# EAGLE design mini_metrix_clock (EAGLE 8.6.3)
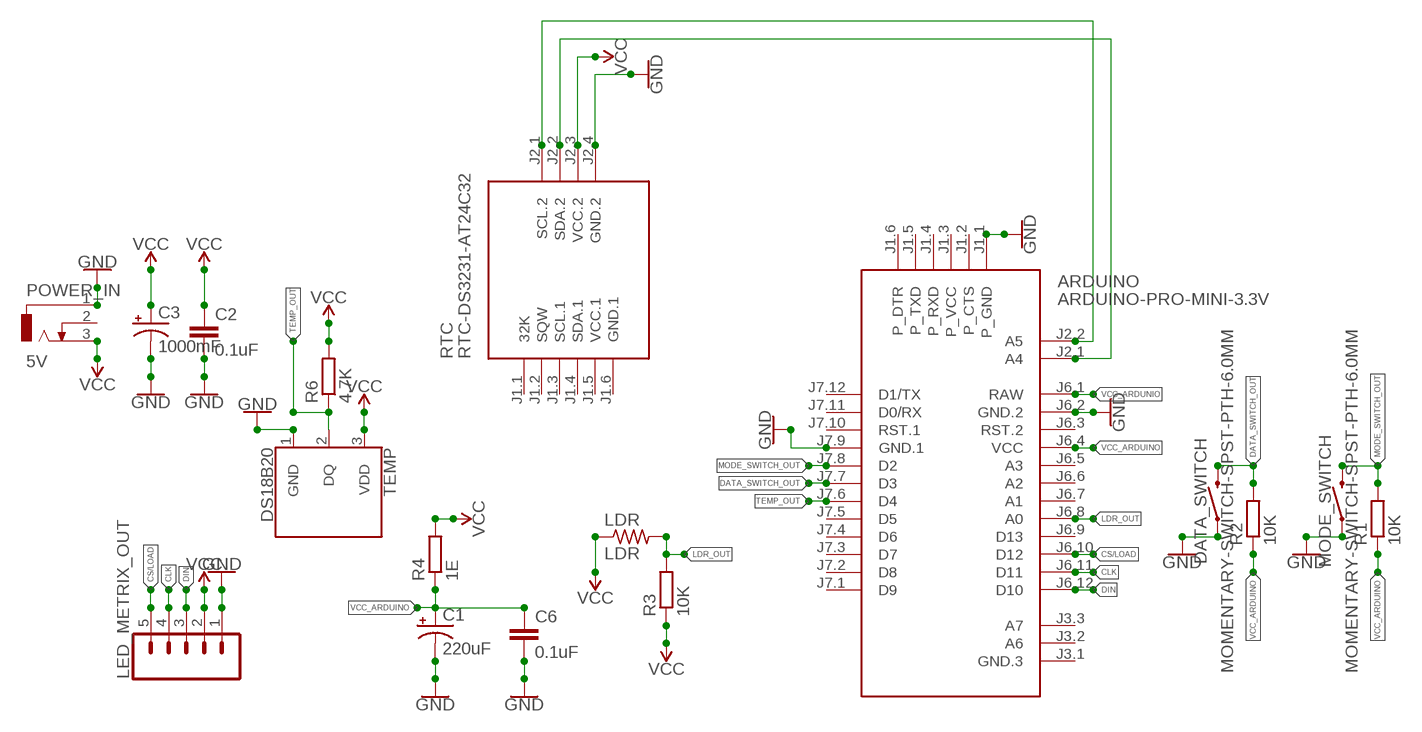
[diagram p0: schematic, sheet 1]

## Parts
ARDUINO  ARDUINO-PRO-MINI-3.3V  [ARDUINO-PRO-MINI]
C1  220uF  100UF-POLAR-RADIAL-2.5MM-25V-20%  [CPOL-RADIAL-2.5MM-6.5MM]
C2  0.1uF  0.1UF-KIT-EZ-50V-20%  [CAP-PTH-SMALL-KIT]
C3  1000mF  1000UF-RADIAL-5MM-25V-20%  [CPOL-RADIAL-5MM-10MM]
C6  0.1uF  0.1UF-KIT-EZ-50V-20%  [CAP-PTH-SMALL-KIT]
DATA_SWITCH  MOMENTARY-SWITCH-SPST-PTH-6.0MM  [TACTILE_SWITCH_PTH_6.0MM]
LDR  LDR  R-US_0204/2V  [0204V]
LED_METRIX_OUT  CONN_05PTH_LONGPADS  [1X05_LONGPADS]
MODE_SWITCH  MOMENTARY-SWITCH-SPST-PTH-6.0MM  [TACTILE_SWITCH_PTH_6.0MM]
POWER_IN  5V  DCJ0303  [DCJ0303]
R1  10K  R-EU_0207/7  [0207/7]
R2  10K  R-EU_0207/7  [0207/7]
R3  10K  R-EU_0207/7  [0207/7]
R4  1E  R-EU_0207/7  [0207/7]
R6  4.7K  R-EU_0207/7  [0207/7]
RTC  RTC-DS3231-AT24C32  [RTC-DS3231-AT24C32]
TEMP  DS18B20  [TO-92-AMMO]

## Nets
CLK: ARDUINO.J6.11(D11) LED_METRIX_OUT.4
CS/LOAD: ARDUINO.J6.10(D12) LED_METRIX_OUT.5
DATA_SWITCH_OUT: ARDUINO.J7.7(D3) DATA_SWITCH.3 R2.2
DIN: ARDUINO.J6.12(D10) LED_METRIX_OUT.3
GND: ARDUINO.J1.1(P_GND) ARDUINO.J6.2(GND.2) ARDUINO.J7.9(GND.1) C1.2(-) C2.2 C3.- C6.2 DATA_SWITCH.1 LED_METRIX_OUT.1 MODE_SWITCH.1 POWER_IN.1 RTC.J2.4(GND.2) TEMP.1(GND)
LDR_OUT: ARDUINO.J6.8(A0) LDR.2 R3.2
MODE_SWITCH_OUT: ARDUINO.J7.8(D2) MODE_SWITCH.3 R1.2
N$1: ARDUINO.J2.1(A4) RTC.J2.2(SDA.2)
N$2: ARDUINO.J2.2(A5) RTC.J2.1(SCL.2)
TEMP_OUT: ARDUINO.J7.6(D4) R6.1 TEMP.2(DQ)
VCC: C2.1 C3.+ LDR.1 LED_METRIX_OUT.2 POWER_IN.3 R3.1 R4.2 R6.2 RTC.J2.3(VCC.2) TEMP.3(VDD)
VCC_ARDUINO: ARDUINO.J6.4(VCC) C1.1(+) C6.1 R1.1 R2.1 R4.1
VCC_ARDUNIO: ARDUINO.J6.1(RAW)
Unconnected: ARDUINO.J1.2(P_CTS) ARDUINO.J1.3(P_VCC) ARDUINO.J1.4(P_RXD) ARDUINO.J1.5(P_TXD) ARDUINO.J1.6(P_DTR) ARDUINO.J3.1(GND.3) ARDUINO.J3.2(A6) ARDUINO.J3.3(A7) ARDUINO.J6.3(RST.2) ARDUINO.J6.5(A3) ARDUINO.J6.6(A2) ARDUINO.J6.7(A1) ARDUINO.J6.9(D13) ARDUINO.J7.1(D9) ARDUINO.J7.2(D8) ARDUINO.J7.3(D7) ARDUINO.J7.4(D6) ARDUINO.J7.5(D5) ARDUINO.J7.10(RST.1) ARDUINO.J7.11(D0/RX) ARDUINO.J7.12(D1/TX) POWER_IN.2 RTC.J1.1(32K) RTC.J1.2(SQW) RTC.J1.3(SCL.1) RTC.J1.4(SDA.1)

## Power pins joined to a net without a drawn wire
GND.1: RTC.J1.6(GND.1)
VCC.1: RTC.J1.5(VCC.1)

## Library data of the parts
ARDUINO = diy-modules:ARDUINO-PRO-MINI-*: Arduino Pro Mini and compatible devices More details available here: https://www.arduino.cc/en/Main/ArduinoBoardProMini Click here to find device on ebay.com <http://www.ebay.com/sch/arduino+pro+mini>
C1 = SparkFun-Capacitors:100UF-POLAR: 100µF polarized capacitors A capacitor is a passive two-terminal electrical component used to store electrical energy temporarily in an electric field.; PROD_ID: CAP-08439; VALUE: 100uF
C2 C6 = SparkFun-Capacitors:0.1UF: 0.1µF ceramic capacitors A capacitor is a passive two-terminal electrical component used to store electrical energy temporarily in an electric field.; PROD_ID: CAP-08370
C3 = SparkFun-Capacitors:1000UF: 1,000µF/1mF ceramic capacitors A capacitor is a passive two-terminal electrical component used to store electrical energy temporarily in an electric field. CAP-08070; PROD_ID: CAP-09538; VALUE: 1mF
DATA_SWITCH MODE_SWITCH = SparkFun-Switches:MOMENTARY-SWITCH-SPST: Momentary Switch (Pushbutton) - SPST Normally-open (NO) SPST momentary switches (buttons, pushbuttons). Variants PTH-12MM - 12mm square, through-hole Momentary Pushbutton Switch - 12mm Square <https://www.sparkfun.com/products/9190> (COM-09190) PTH-6.0MM, PTH-6.0MM-KIT - 6.0mm square, through-hole Mini Pushbutton Switch <https://www.sparkfun.com/products/97> (COM-00097) KIT package intended for soldering kit's - only one side of pads' copper is exposed. PTH-RIGHT-ANGLE-KIT - Right-angle, through-hole Right Angle Tactile Button <https://www.sparkfun.com/products/10791> - Used on SparkFun BigTime Watch Kit <https://www.sparkfun.com/products/11734> SMD-12MM - 12mm square, surface-mount Tactile Button - SMD (12mm) <https://www.sparkfun.com/products/12993> (COM-12993) Used on SparkFun PicoBoard <https://www.sparkfun.com/products/11888> SMD-4.5MM - 4.5mm Square Trackball Switch Used on SparkFun Blackberry Trackballer Breakout <https://www.sparkfun.com/products/13169> SMD-4.6MMX2.8MM - 4.60mm x 2.80mm, surface mount Used on SparkFun SAMD21 Mini Breakout <https://www.sparkfun.com/products/13664> SMD-5.2MM, SMD-5.2-REDUNDANT - 5.2mm square, surface-mount Mini Pushbutton Switch - SMD <https://www.sparkfun.com/products/8720> (COM-08720) Used on Arduino Pro Mini <https://www.sparkfun.com/products/11114> REDUNDANT package connects both switch circuits together SMD-6.0X3.5MM - 6.0 x 3.5mm, surface mount Momentary Reset Switch SMD <https://www.sparkfun.com/products/8229> (COM-08229) SMD-6.2MM-TALL - 6.2mm square, surface mount Tactile Button - SMD (6mm) <https://www.sparkfun.com/products/12992> Used on SparkFun Digital Sandbox <https://www.sparkfun.com/products/12651> SMD-RIGHT-ANGLE - Right-angle, surface mount Used on SparkFun Block for Intel® Edison - Arduino <https://www.sparkfun.com/products/13036>; PROD_ID: SWCH-08441; SF_SKU: COM-00097
LDR = rcl:R-US_: RESISTOR, American symbol
LED_METRIX_OUT = SparkFun-Connectors:CONN_05: Multi connection point. Often used as Generic Header-pin footprint for 0.1 inch spaced/style header connections On any of the 0.1 inch spaced packages, you can populate with these: Break Away Headers - Straight <https://www.sparkfun.com/products/116> (PRT-00116) Break Away Male Headers - Right Angle <https://www.sparkfun.com/products/553> (PRT-00553) Female Headers <https://www.sparkfun.com/products/115> (PRT-00115) Break Away Headers - Machine Pin <https://www.sparkfun.com/products/117> (PRT-00117) Break Away Female Headers - Swiss Machine Pin <https://www.sparkfun.com/products/743> (PRT-00743) For SCREWTERMINALS and SPRING TERMINALS visit here: Screw Terimnals on SparkFun.com <https://www.sparkfun.com/search/results?term=Screw+Terminals> (5mm/3.5mm/2.54mm spacing) This device is also useful as a general connection point to wire up your design to another part of your project. Our various solder wires solder well into these plated through hole pads. Hook-Up Wire - Assortment (Stranded, 22 AWG) <https://www.sparkfun.com/products/11375> (PRT-11375) Hook-Up Wire - Assortment (Solid Core, 22 AWG) <https://www.sparkfun.com/products/11367> (PRT-11367) View the entire wire category on our website here <https://www.sparkfun.com/categories/141> Special notes: Molex polarized connector foot print use with SKU : PRT-08231 with associated crimp pins and housings. 1MM SMD Version SKU: PRT-10208
POWER_IN = con-jack:DCJ0303: DC POWER JACK Source: DCJ0303.pdf; OC_FARNELL: unknown; OC_NEWARK: unknown
R1-R4 R6 = rcl:R-EU_: RESISTOR, European symbol; SPICEPREFIX: R
RTC = diy-modules:RTC-DS3231-AT24C32: RTC Module with Battery and EEPROM based on DS3231 and AT24C32 chips Tutorial can be found here: https://edwardmallon.wordpress.com/2014/05/21/using-a-cheap-3-ds3231-rtc-at24c32-eeprom-from-ebay/ Click here to find device on ebay.com <http://www.ebay.com/sch/DS3231+AT24C32+module>
TEMP = SparkFun-Sensors:DS18B20: Dallas/Maxim DS18B20 1-Wire Temperature Sensor The DS18B20 reports degrees C with 9 to 12-bit precision, -55C to 125C (+/-0.5C). Each sensor has a unique 64-Bit Serial number etched into it - allows for a huge number of sensors to be used on one data bus. Datasheet <http://datasheets.maximintegrated.com/en/ds/DS18B20.pdf> SparkFun Products One Wire Digital Temperature Sensor - DS18B20 <https://www.sparkfun.com/products/245> (SEN-00245); STORE_ID: SEN-00245

## Board
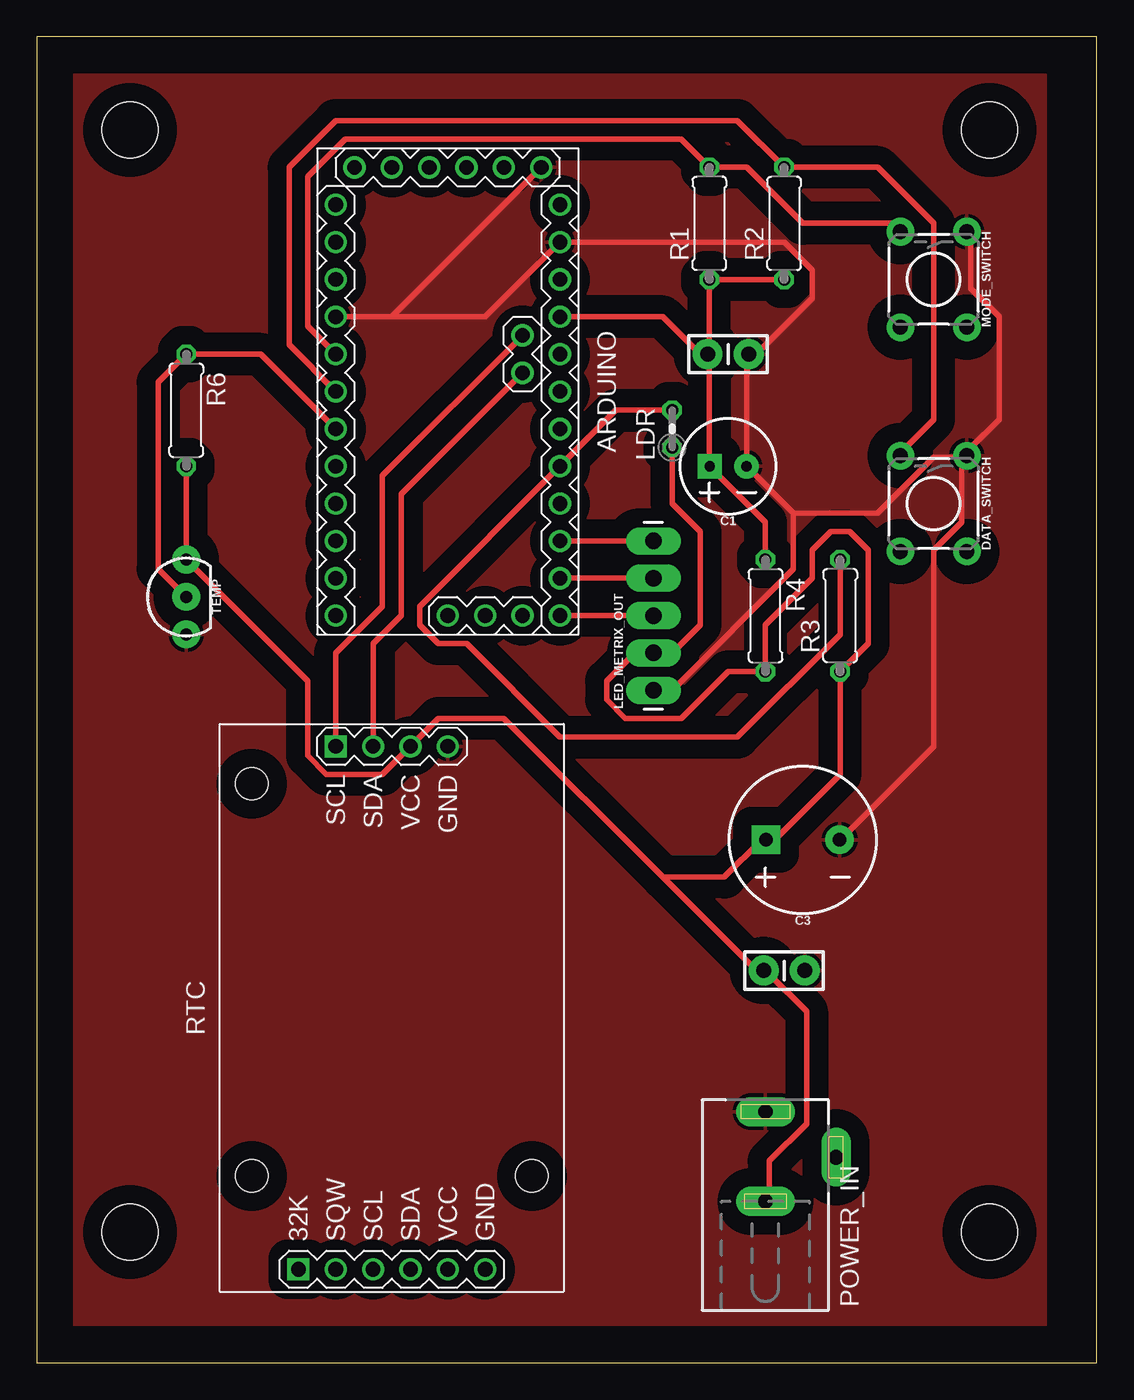
[diagram p1: board, top side]

Size 72.06 x 90.16 mm. Coordinates in mm from the lower left corner, seen from the top.
Outline: 0,0 72.06,0 72.06,90.16 0,90.16 0,0
Copper layers (1*16): Top 0.035mm / dielectric 1.5mm / Bottom 0.035mm
Design rules "default *": minimum track width 15mil, minimum drill 1mm, track to track 25mil, track to pad 20mil, pad to pad 6mil, via to via 6mil, smd to smd 6mil, copper to edge 40mil, drill to drill 6mil, minimum pad ring 10mil, minimum via ring 8mil, stop-mask expansion 4mil, vias tented up to drill 0mil, thermal gap 10mil
Holes 3.81 mm at 6.35,83.82 64.77,83.82 64.77,8.89 6.35,8.89

### Footprints (pad centres in the part's own frame; a part is rotated, then mirrored left to right if it is on the bottom)
ARDUINO-PRO-MINI = drill 1: J1.1 -15.24,6.35; J1.2 -15.24,3.81; J1.3 -15.24,1.27; J1.4 -15.24,-1.27; J1.5 -15.24,-3.81; J1.6 -15.24,-6.35; J2.1 -1.27,5.08; J2.2 -3.81,5.08; J3.1 15.24,0; J3.2 15.24,2.54; J3.3 15.24,5.08; J6.1 -12.7,7.62; J6.2 -10.16,7.62; J6.3 -7.62,7.62; J6.4 -5.08,7.62; J6.5 -2.54,7.62; J6.6 0,7.62; J6.7 2.54,7.62; J6.8 5.08,7.62; J6.9 7.62,7.62; J6.10 10.16,7.62; J6.11 12.7,7.62; J6.12 15.24,7.62; J7.1 15.24,-7.62; J7.2 12.7,-7.62; J7.3 10.16,-7.62; J7.4 7.62,-7.62; J7.5 5.08,-7.62; J7.6 2.54,-7.62; J7.7 0,-7.62; J7.8 -2.54,-7.62; J7.9 -5.08,-7.62; J7.10 -7.62,-7.62; J7.11 -10.16,-7.62; J7.12 -12.7,-7.62
CPOL-RADIAL-2.5MM-6.5MM = drill 0.7 pad 1.651 square: 1 1.25,0 | drill 0.7 pad 1.651: 2 -1.25,0
CAP-PTH-SMALL-KIT = drill 1.016 pad 2.032: 1 -1.397,0; 2 1.397,0
CPOL-RADIAL-5MM-10MM = drill 0.9 pad 1.93 square: + 2.5,0 | drill 0.9 pad 1.93: - -2.5,0
TACTILE_SWITCH_PTH_6.0MM = drill 1.016 pad 1.88: 1 -3.251,2.261; 2 3.251,2.261; 3 -3.251,-2.261; 4 3.251,-2.261
0204V = drill 0.813 octagon: 1 -1.27,0; 2 1.27,0
1X05_LONGPADS = drill 1.118 pad 1.88 long: 1 0,0; 2 2.54,0; 3 5.08,0; 4 7.62,0; 5 10.16,0
DCJ0303 = drill 1 pad 2 long: 1 0,3.1; 2 4.8,0; 3 0,-3
0207/7 = drill 0.813 octagon: 1 -3.81,0; 2 3.81,0
RTC-DS3231-AT24C32 = drill 1 square: J1.1 -17.78,6.35; J2.1 17.78,3.81 | drill 1: J1.2 -17.78,3.81; J1.3 -17.78,1.27; J1.4 -17.78,-1.27; J1.5 -17.78,-3.81; J1.6 -17.78,-6.35; J2.2 17.78,1.27; J2.3 17.78,-1.27; J2.4 17.78,-3.81 | hole 2.2: -11.43,-9.525; -11.43,9.525; 15.24,9.525
TO-92-AMMO = drill 0.813 pad 1.88: 1 -2.54,0; 2 0,0; 3 2.54,0

### Placement (x,y rotation side)
ARDUINO  27.94,66.04 270 top
C1  46.99,60.96 180 top
C2  50.8,26.67 0 top
C3  52.07,35.56 180 top
C6  46.99,68.58 0 top
DATA_SWITCH  60.96,58.42 270 top
LDR  43.18,63.5 90 top
LED_METRIX_OUT  41.91,45.72 90 top
MODE_SWITCH  60.96,73.66 270 top
POWER_IN  49.53,13.97 0 top
R1  45.72,77.47 90 top
R2  50.8,77.47 90 top
R3  54.61,50.8 90 top
R4  49.53,50.8 270 top
R6  10.16,64.77 270 top
RTC  24.13,24.13 90 top
TEMP  10.16,52.07 90 top

### Tracks (layer width: path | path; a pad name or v marks a point on that pad's centre or on a via)
CLK
  Top 0.381: LED_METRIX_OUT.4 ARDUINO.J6.11
CS/LOAD
  Top 0.381: LED_METRIX_OUT.5 ARDUINO.J6.10
DATA_SWITCH_OUT
  Top 0.381: DATA_SWITCH.3 59.05,62.23 60.96,64.14 60.96,77.47 57.15,81.28 R2.2 47.62,84.45 20.32,84.45 17.14,81.28 17.14,69.22 ARDUINO.J7.7
DIN
  Top 0.381: LED_METRIX_OUT.3 ARDUINO.J6.12
GND
  Top 0.381: 24.13,71.12 30.48,71.12 ARDUINO.J6.2 50.8,76.2 52.7,74.3 52.7,72.39 48.9,68.58 C6.2 48.26,68.58 48.26,60.96 | 24.13,71.12 ARDUINO.J7.9 | 24.13,71.12 ARDUINO.J1.1 | LED_METRIX_OUT.1 43.18,45.72 51.44,53.98 51.44,57.78 | 48.26,60.96 51.44,57.78 | 48.26,60.96 C1.2 | 62.87,61.59 60.96,61.59 57.15,57.78 51.44,57.78 | MODE_SWITCH.1 63.5,76.84 63.5,73.03 65.41,71.12 65.41,64.14 63.5,62.23 DATA_SWITCH.1 62.87,61.59 | 62.87,61.59 62.87,57.15 60.96,55.25 60.96,41.91 54.61,35.56 C3.-
  pour Top (isolate 1.27): 2.54,87.63 68.58,87.63 68.58,2.54 2.54,2.54 2.54,3.81
LDR_OUT
  Top 0.381: LDR.2 39.37,64.77 ARDUINO.J6.8 26.04,51.44 26.04,50.17 27.3,48.89 29.21,48.89 35.56,42.55 47.62,42.55 54.61,49.53 R3.2
MODE_SWITCH_OUT
  Top 0.381: MODE_SWITCH.3 58.42,77.47 52.07,77.47 48.26,81.28 R1.2 43.81,83.19 20.95,83.19 18.41,80.65 18.41,70.48 ARDUINO.J7.8
N$1
  Top 0.381: RTC.J2.2 22.86,48.89 24.77,50.8 24.77,59.06 ARDUINO.J2.1
N$2
  Top 0.381: RTC.J2.1 20.32,48.26 23.5,51.44 23.5,60.33 ARDUINO.J2.2
TEMP_OUT
  Top 0.381: ARDUINO.J7.6 15.24,68.58 R6.1 8.26,66.67 8.26,53.98 TEMP.2
VCC
  Top 0.381: LDR.1 43.18,58.42 45.09,56.52 45.09,50.17 43.18,48.26 LED_METRIX_OUT.2 40.64,48.26 38.73,46.36 38.73,45.08 40.01,43.81 43.81,43.81 46.99,46.99 R4.2 49.53,50.17 52.7,53.34 52.7,55.25 53.98,56.52 55.24,56.52 56.52,55.25 56.52,48.89 R3.1 54.61,40 50.16,35.56 C3.+ 49.28,35.56 46.74,33.02 42.67,33.02 42.61,32.96 | R6.2 TEMP.3 18.41,46.36 18.41,41.28 19.68,40 23.5,40 RTC.J2.3 27.3,43.81 31.75,43.81 42.61,32.96 | 42.61,32.96 48.9,26.67 C2.1 49.78,26.42 52.32,23.88 52.32,16.26 49.78,13.72 49.78,11.18 POWER_IN.3
VCC_ARDUINO
  Top 0.381: 45.21,68.58 C6.1 | R4.1 49.53,57.15 45.72,60.96 | R2.1 R1.1 45.72,68.58 | ARDUINO.J6.4 42.55,71.12 45.09,68.58 C6.1 | 45.72,68.58 45.72,60.96 | 45.72,60.96 C1.1 | 45.72,68.58 C6.1